# Altium schematic sheet IntegroDiferencial_SCH.SchDoc
size A4
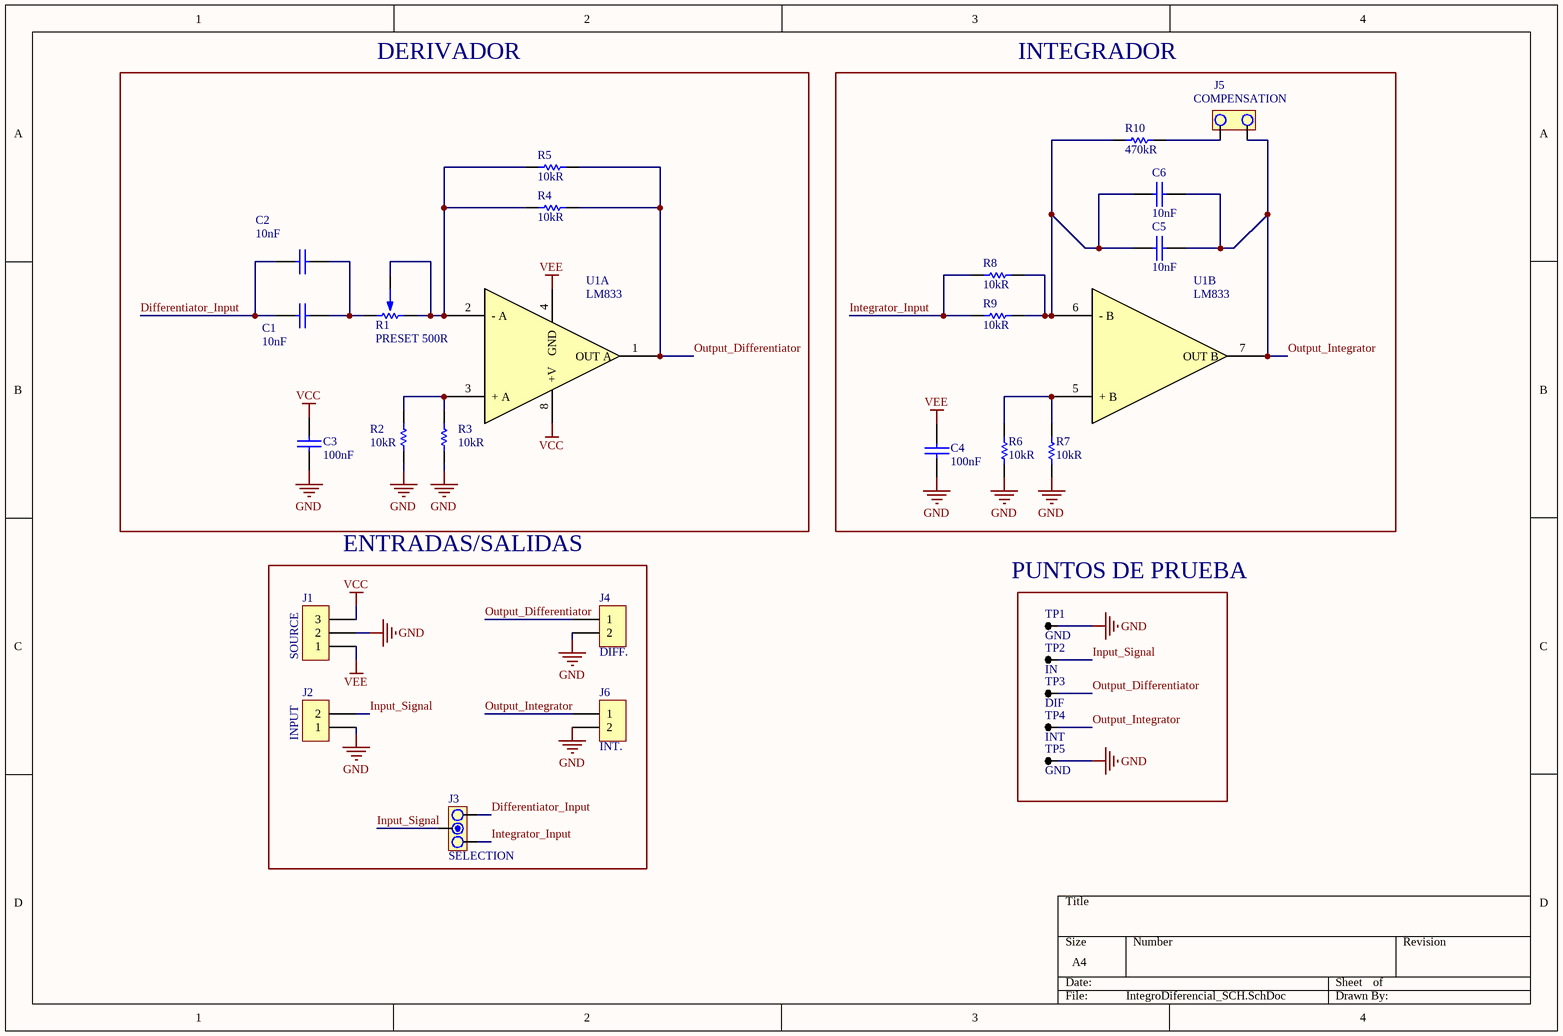
[diagram p0: IntegroDiferencial_SCH.SchDoc]

## Parts
C1  10nF  [0805]
C2  10nF  [0805]
C3  100nF  [0805]
C4  100nF  [0805]
C5  10nF  [0805]
C6  10nF  [0805]
J1  SOURCE  [BORNERA3]
J2  INPUT  [BORNERA2]
J3  SELECTION  [JUMPER3]
J4  DIFF.  [BORNERA2]
J5  COMPENSATION  [JUMPER2]
J6  INT.  [BORNERA2]
R1  PRESET 500R  [PRESET V]
R2  10kR  [0805]
R3  10kR  [0805]
R4  10kR  [0805]
R5  10kR  [0805]
R6  10kR  [0805]
R7  10kR  [0805]
R8  10kR  [0805]
R9  10kR  [0805]
R10  470kR  [0805]
TP1  GND  [TPTH]
TP2  IN  [TPTH]
TP3  DIF  [TPTH]
TP4  INT  [TPTH]
TP5  GND  [TPTH]
U1  LM833  [DIP8]  (parts A,B of 2)

## Blocks framed on the sheet
DERIVADOR: C1-C3 R1-R5 U1
INTEGRADOR: C4-C6 J5 R6-R10 U1
ENTRADAS/SALIDAS: J1-J4 J6

## Nets
GND: C3.1 C4.1 J1.2 J2.1 J4.2 J6.2 R2.1 R3.1 R6.1 R7.1 TP1.1 TP5.1
VCC: C3.2 J1.3 U1.8(+V)
VEE: C4.2 J1.1 U1.4(GND)
Differentiator_Input: C1.1 C2.1 J3.1
Input_Signal: J2.2 J3.2 TP2.1
Integrator_Input: J3.3 R8.1 R9.1
Output_Differentiator: J4.1 R4.1 R5.1 TP3.1 U1.1(OUT_A)
Output_Integrator: C5.1 C6.1 J5.1 J6.1 TP4.1 U1.7(OUT_B)
NetC1_2: C1.2 C2.2 R1.1
NetC5_2: C5.2 C6.2 R8.2 R9.2 R10.1 U1.6(-_B)
NetJ5_2: J5.2 R10.2
NetR1_2: R1.2 R1.3 R4.2 R5.2 U1.2(-_A)
NetR2_2: R2.2 R3.2 U1.3(+_A)
NetR6_2: R6.2 R7.2 U1.5(+_B)

## Notes on the sheet
- (near TP1) PUNTOS DE PRUEBA

## Library data of the parts
C1 C2 C5 C6 = CAP: CAP 10nF 0805
C3 C4 = CAP: CAP 100nF 0805
J1 = BORNERA 3
J2 J4 J6 = BORNERA 2
J3 = JUMPER3: JUMPER
J5 = JUMPER
R1 = PRESET
R2-R9 = RES: RES 10kR 0805
R10 = RES: RES 470kR 0805
TP1-TP5 = TP: TESTPOINT
U1 = LM833: Dual Audio Operational Amplifier